# EAGLE design Pneumatic Pulse Controller (EAGLE 7.6.0)
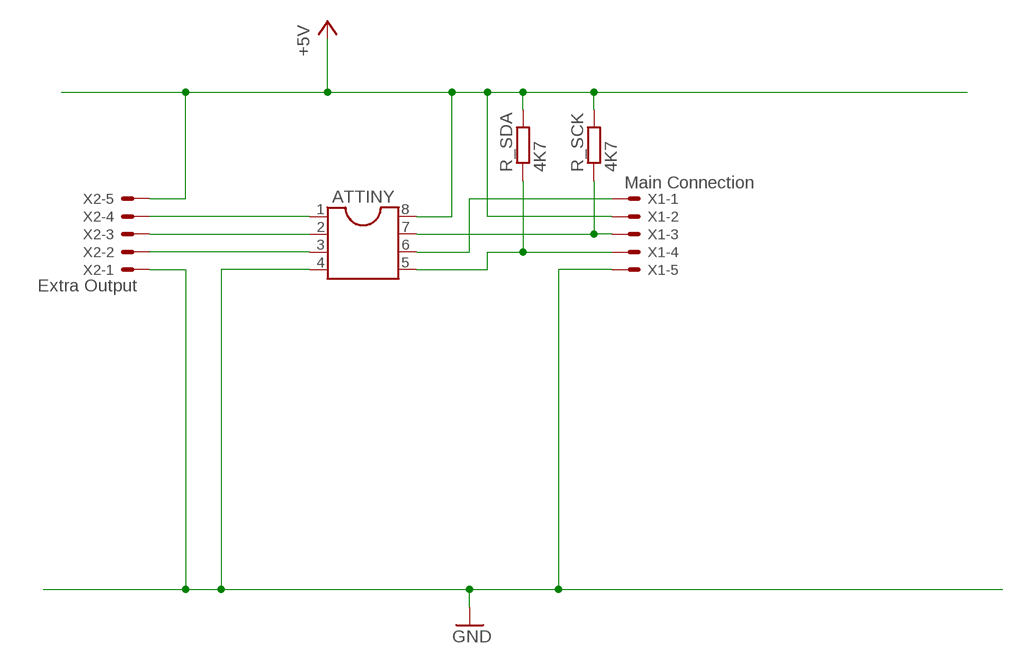
[diagram p0: schematic, sheet 1]

## Parts
ATTINY  DIL8  [DIL08]
R_SCK  4K7  R-EU_M0805  [M0805]
R_SDA  4K7  R-EU_M0805  [M0805]
X1  Main Connection  KK-156-5  [KK-156-5]
X2  Extra Output  KK-156-5  [KK-156-5]

## Nets
+5V: ATTINY.8 R_SCK.2 R_SDA.2 X1.2 X2.5
GND: ATTINY.4 X1.5 X2.1
N$1: ATTINY.1 X2.4
N$3: ATTINY.2 X2.3
N$5: ATTINY.3 X2.2
SCK: ATTINY.7 R_SCK.1 X1.3
SDA: ATTINY.5 R_SDA.1 X1.4
VOUT: ATTINY.6 X1.1

## Library data of the parts
ATTINY = ic-package:DIL8: Dual In Line / Socket
R_SCK R_SDA = rcl:R-EU_: RESISTOR, European symbol
X1 X2 = con-molex:KK-156-5: KK 156 HEADER Source: http://www.molex.com/pdm_docs/sd/026604100_sd.pdf; OC_FARNELL: unknown; OC_NEWARK: unknown

## Board
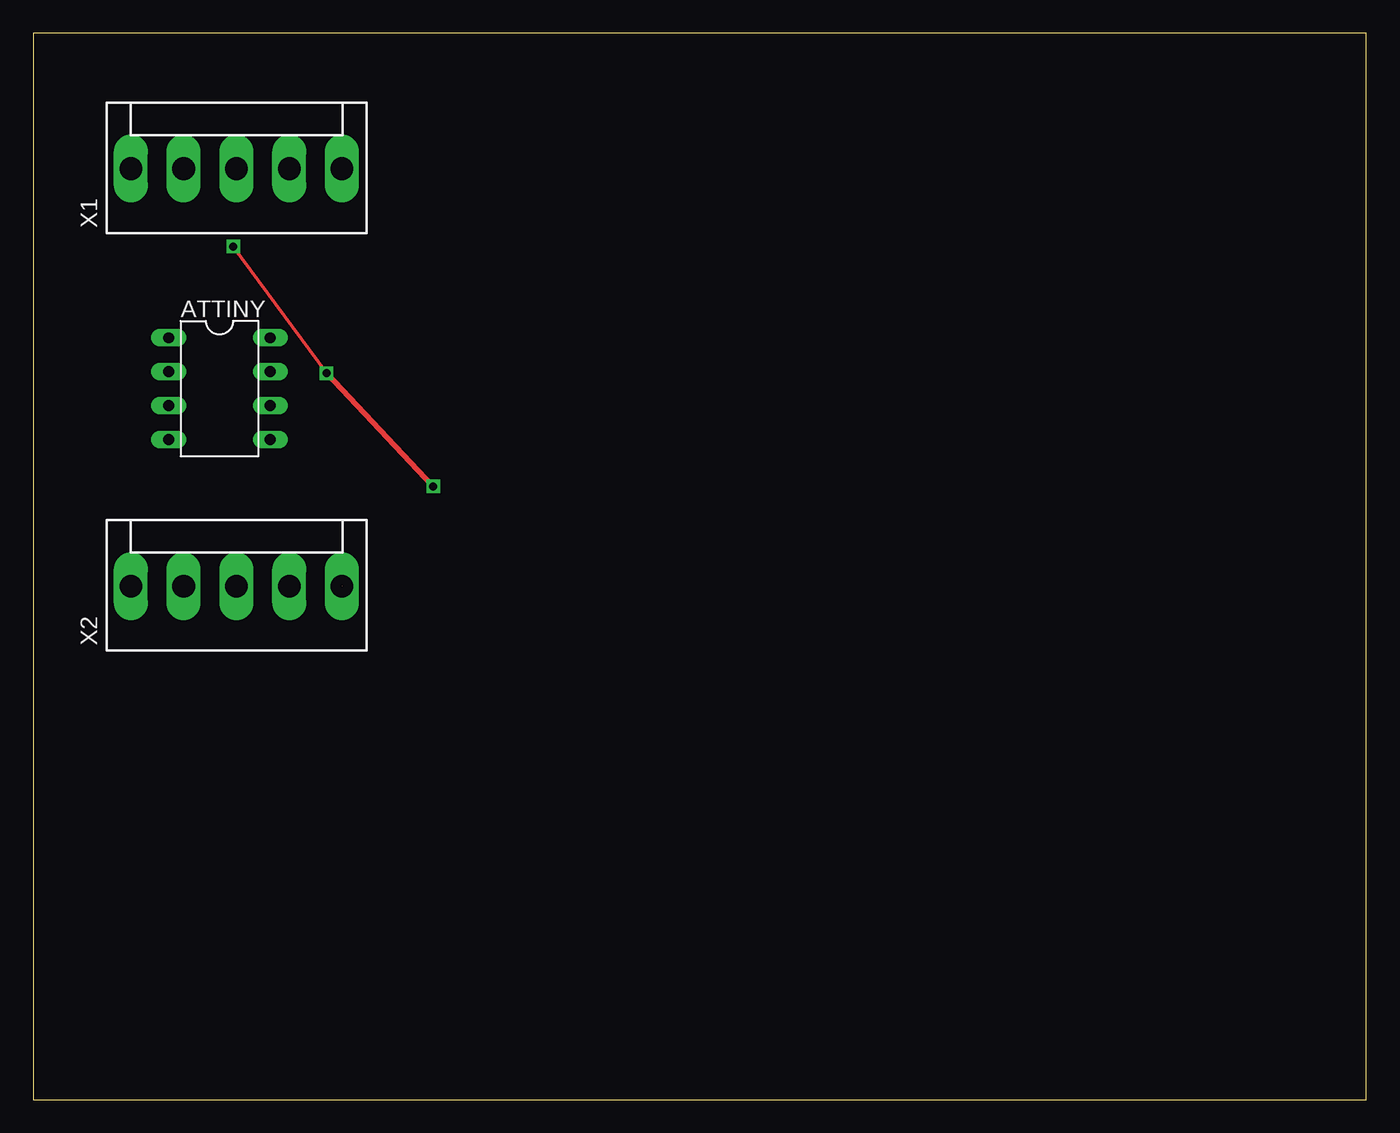
[diagram p1: board, top side]
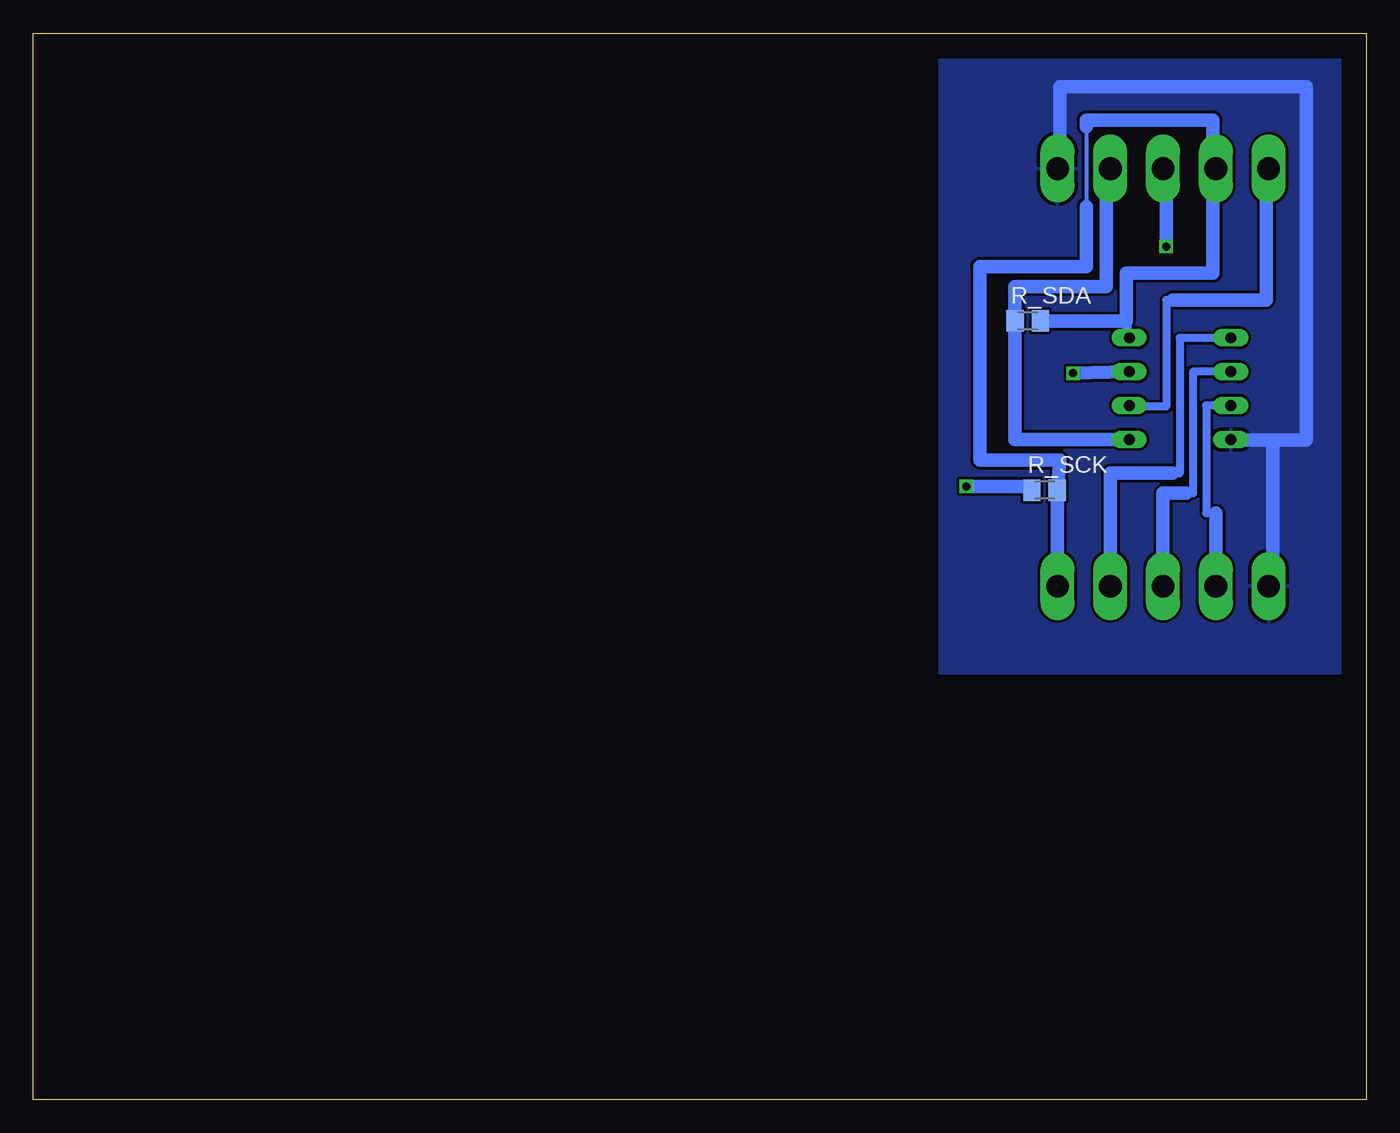
[diagram p2: board, bottom side, seen from below]

Size 100 x 80 mm. Coordinates in mm from the lower left corner, seen from the top.
Outline: 0,0 100,0 100,80 0,80 0,0
Copper layers (1*16): Top 0.035mm / dielectric 1.5mm / Bottom 0.035mm
Design rules "default": minimum track width 10mil, minimum drill 24mil, track to track 8mil, track to pad 8mil, pad to pad 8mil, via to via 8mil, smd to smd 8mil, copper to edge 40mil, drill to drill 8mil, minimum pad ring 10mil, minimum via ring 8mil, stop-mask expansion 4mil, vias tented up to drill 0mil, thermal gap 10mil

### Footprints (pad centres in the part's own frame; a part is rotated, then mirrored left to right if it is on the bottom)
DIL08 = drill 0.813 long: 1 -3.81,-3.81; 2 -1.27,-3.81; 3 1.27,-3.81; 4 3.81,-3.81; 5 3.81,3.81; 6 1.27,3.81; 7 -1.27,3.81; 8 -3.81,3.81
M0805 = smd 1.3 x 1.6: 1 -0.95,0; 2 0.95,0
KK-156-5 = drill 1.7 pad 2.184 long: 1 -7.92,0; 2 -3.96,0; 3 0,0; 4 3.96,0; 5 7.92,0

### Placement (x,y rotation side)
ATTINY  13.97,53.34 270 top
R_SCK  24.13,45.72 0 bottom
R_SDA  25.4,58.42 0 bottom
X1  15.24,69.85 0 top
X2  15.24,38.52 0 top

### Tracks (layer width: path | path; a pad name or v marks a point on that pad's centre or on a via)
+5V  (1 unrouted)
  Bottom 0.305: 21,73 21,67
  Bottom 0.406: ATTINY.8 18,62
  Bottom 0.61: X1.2 11.5,69.85 | 18,58.42 18,57.5 17.78,57.5 ATTINY.8
  Bottom 1.016: R_SDA.2 18,58.42 18,62 11.5,62 11.5,69.85 11.5,73.5 21,73.5 21,73 | 21,67 21,62.5 29,62.5 29,48 23,48 R_SCK.2 23.18,38.52
GND
  Bottom 0.61: X1.5 23,69.85 | 10.16,49.5 ATTINY.4
  Bottom 1.016: 23,69.85 23,76 4.5,76 4.5,49.5 7,49.5 | 7,49.5 10.16,49.5 | X2.1 7,38.5 7,49.5
  pour Bottom: 2,78 32,78 32,32 2,32
N$1
  Bottom 0.61: ATTINY.1 14,57.15 14,47 14.5,47
  Bottom 1.016: X2.4 19.2,47 14.5,47
N$3
  Bottom 0.61: ATTINY.2 13,54.61 13,45.5 13.5,45.5
  Bottom 1.016: X2.3 15.24,45.5 13.5,45.5
N$5
  Bottom 0.61: ATTINY.3 12,52.07 12,44 11.28,44
  Bottom 1.016: 11.28,44 X2.2
SCK  (via drill 0.6)
  Top 0.254: v15,64 v22,54.5
  Top 0.406: v30,46 v22,54.5
  Bottom 0.406: R_SCK.1 25.5,46
  Bottom 1.016: 25.5,46 v30,46 | v22,54.5 ATTINY.7 | X1.3 15,69.5 v15,64
SDA
  Bottom 0.61: X1.4 19.5,69.85
  Bottom 1.016: ATTINY.5 26.35,49.53 R_SDA.1 26.35,61 19.5,61 19.5,69.85
VOUT
  Bottom 0.406: 14.5,60 15,60
  Bottom 0.61: X1.1 7.5,69.85 | 15,60 15,52 17.78,52 ATTINY.6
  Bottom 1.016: 7.5,69.85 7.5,60 14.5,60